# EAGLE design LPC1343_BaseBoard_V1.6 (EAGLE 6.0)
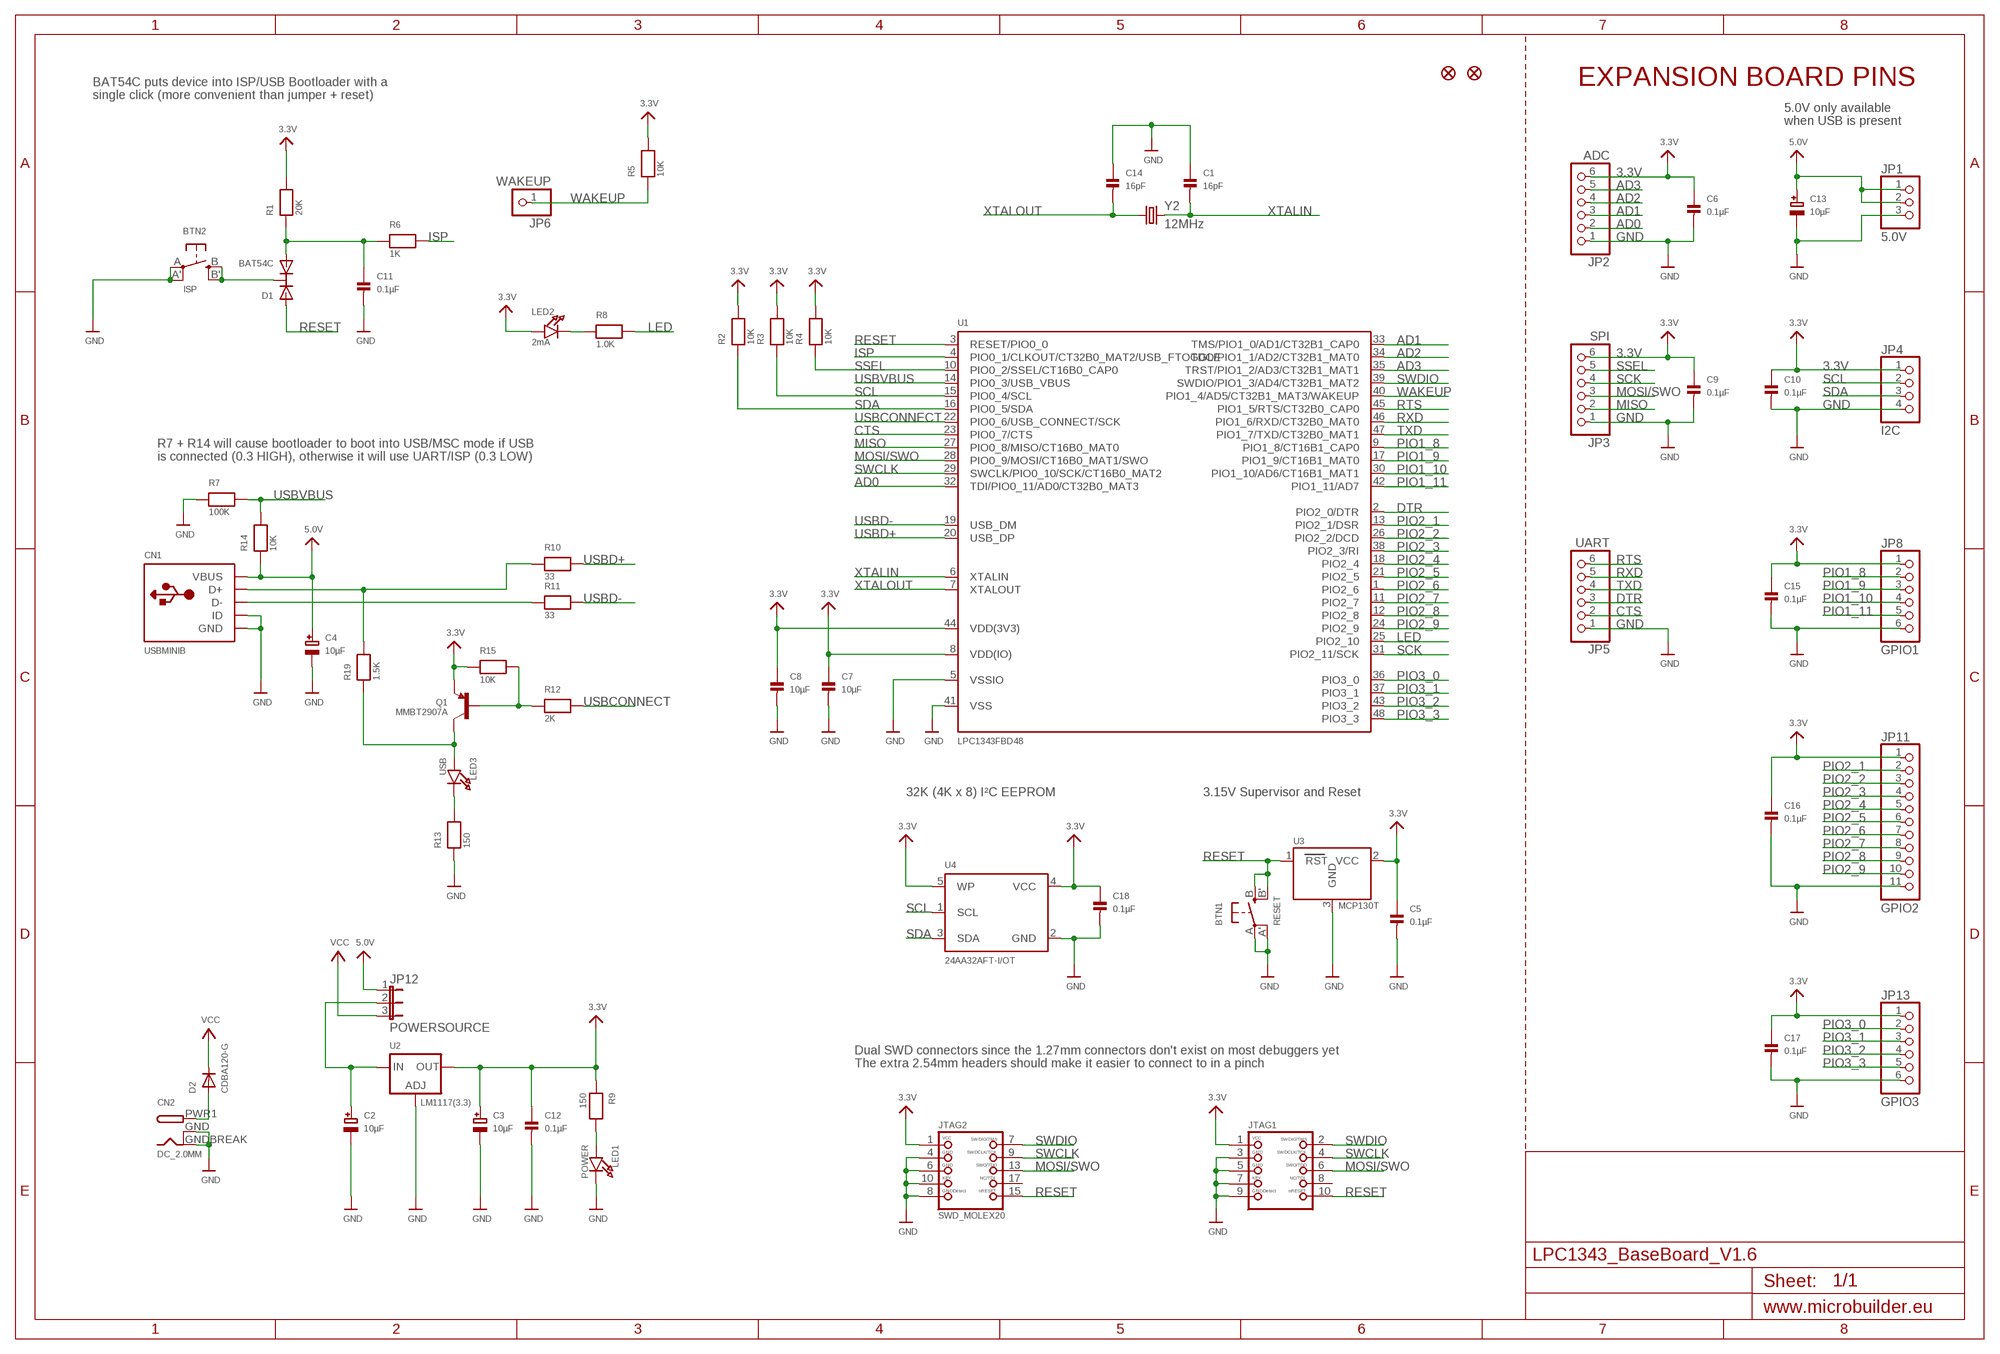
[diagram p0: schematic, sheet 1]

## Parts
BTN1  RESET  BUTTON_SMT  [EVQ-Q2]
BTN2  ISP  BUTTON_SMT  [EVQ-Q2]
C1  16pF  CAP_CERAMIC0603  [0603]
C2  10µF  CAP_TANTALUMA/3216_REFLOW  [EIA3216-18/A-R]
C3  10µF  CAP_TANTALUMA/3216_REFLOW  [EIA3216-18/A-R]
C4  10µF  CAP_TANTALUMA/3216_REFLOW  [EIA3216-18/A-R]
C5  0.1µF  CAP_CERAMIC0603  [0603]
C6  0.1µF  CAP_CERAMIC0603  [0603]
C7  10µF  CAP_CERAMIC0805  [0805]
C8  10µF  CAP_CERAMIC0805  [0805]
C9  0.1µF  CAP_CERAMIC0603  [0603]
C10  0.1µF  CAP_CERAMIC0603  [0603]
C11  0.1µF  CAP_CERAMIC0603  [0603]
C12  0.1µF  CAP_CERAMIC0603  [0603]
C13  10µF  CAP_TANTALUMA/3216_REFLOW  [EIA3216-18/A-R]
C14  16pF  CAP_CERAMIC0603  [0603]
C15  0.1µF  CAP_CERAMIC0603  [0603]
C16  0.1µF  CAP_CERAMIC0603  [0603]
C17  0.1µF  CAP_CERAMIC0603  [0603]
C18  0.1µF  CAP_CERAMIC0603  [0603]
CN1  USBMINIB  [USB-MINIB]
CN2  DC_2.0MM  DCBARRELSMT  [DCJACK_2MM_SMT]
D1  BAT54C  [SOT23-R]
D2  CDBA120-G  DIODESMA  [SMADIODE]
JP1  5.0V  HEADER-1X3ROUND  [1X03_ROUND]
JP2  ADC  HEADER-1X6ROUND  [1X06_ROUND]
JP3  SPI  HEADER-1X6ROUND  [1X06_ROUND]
JP4  I2C  HEADER-1X4ROUND  [1X04_ROUND]
JP5  UART  HEADER-1X6ROUND  [1X06_ROUND]
JP6  WAKEUP  HEADER-1X1ROUND  [1X01_ROUND]
JP7  FIDUCIAL1X2.5  [FIDUCIAL-1X2.5]
JP8  GPIO1  HEADER-1X6ROUND  [1X06_ROUND]
JP9  FIDUCIAL1X2.5  [FIDUCIAL-1X2.5]
JP11  GPIO2  HEADER-1X11  [1X11_ROUND]
JP12  POWERSOURCE  JUMPER3  [JUMPER3]
JP13  GPIO3  HEADER-1X6ROUND  [1X06_ROUND]
JTAG1  JTAG-CORTEXM3  [2X05_1.27MM_SMT]
JTAG2  SWD_MOLEX20  JTAG-CORTEXM3MOLEX20  [JTAG-ARM]
LED1  POWER  LED0805  [CHIPLED_0805]
LED2  2mA  LED0805  [CHIPLED_0805]
LED3  USB  LED0805  [CHIPLED_0805]
Q1  MMBT2907A  TRANSISTOR_PNPSOT23-REFLOW  [SOT23-R]
R1  20K  RESISTOR0603  [0603]
R2  10K  RESISTOR0603  [0603]
R3  10K  RESISTOR0603  [0603]
R4  10K  RESISTOR0603  [0603]
R5  10K  RESISTOR0603  [0603]
R6  1K  RESISTOR0603  [0603]
R7  100K  RESISTOR0603  [0603]
R8  1.0K  RESISTOR0603  [0603]
R9  150  RESISTOR0603  [0603]
R10  33  RESISTOR0603  [0603]
R11  33  RESISTOR0603  [0603]
R12  2K  RESISTOR0603  [0603]
R13  150  RESISTOR0603  [0603]
R14  10K  RESISTOR0603  [0603]
R15  10K  RESISTOR0603  [0603]
R19  1.5K  RESISTOR0603  [0603]
U1  LPC1343FBD48  LPC1343_QFP  [LQFP48]
U2  LM1117(3.3)  LM1117SOT223-REFLOW  [SOT223-R]
U3  MCP130T  MCP130TREFLOW  [SOT23-R]
U4  24AA32AFT-I/OT  MCP24AA32  [SOT23-5]
Y2  12MHz  CRYSTALHC49S  [HC49/S]

## Nets
3.3V: C3.+ C5.1 C6.1 C7.1 C8.1 C9.1 C10.1 C12.1 C15.1 C16.1 C17.1 C18.1 JP2.6 JP3.6 JP4.1 JP8.1 JP11.1 JP13.1 JTAG1.1 JTAG2.1 LED2.A Q1.2(E) R1.2 R2.2 R3.2 R4.2 R5.2 R9.1 R15.1 U1.8(VDD(IO)) U1.44(VDD(3V3)) U2.2(OUT) U3.2(VCC) U4.4(VCC) U4.5(WP)
5.0V: C4.+ C13.+ CN1.VBUS JP1.1 JP1.2 JP12.1 R14.1
AD0: JP2.2 U1.32(TDI/PIO0_11/AD0/CT32B0_MAT3)
AD1: JP2.3 U1.33(TMS/PIO1_0/AD1/CT32B1_CAP0)
AD2: JP2.4 U1.34(TDO/PIO1_1/AD2/CT32B1_MAT0)
AD3: JP2.5 U1.35(TRST/PIO1_2/AD3/CT32B1_MAT1)
CTS: JP5.2 U1.23(PIO0_7/CTS)
DTR: JP5.3 U1.2(PIO2_0/DTR)
GND: BTN1.A'(P1) BTN1.A(P) BTN2.A'(P1) BTN2.A(P) C1.1 C2.- C3.- C4.- C5.2 C6.2 C7.2 C8.2 C9.2 C10.2 C11.2 C12.2 C13.- C14.1 C15.2 C16.2 C17.2 C18.2 CN1.GND CN1.ID CN2.GND(GNDBREAK) CN2.GNDBREAK(GND) JP1.3 JP2.1 JP3.1 JP4.4 JP5.1 JP8.6 JP11.11 JP13.6 JTAG1.3 JTAG1.5 JTAG1.7 JTAG1.9 JTAG2.4 JTAG2.6 JTAG2.8 JTAG2.10 LED1.C R7.1 R13.1 U1.5(VSSIO) U1.41(VSS) U2.1(ADJ) U3.3(GND) U4.2(GND)
ISP: R6.2 U1.4(PIO0_1/CLKOUT/CT32B0_MAT2/USB_FTOGGLE)
LED: R8.2 U1.25(PIO2_10)
MISO: JP3.2 U1.27(PIO0_8/MISO/CT16B0_MAT0)
MOSI/SWO: JP3.3 JTAG1.6 JTAG2.13 U1.28(PIO0_9/MOSI/CT16B0_MAT1/SWO)
N$1: LED2.C R8.1
N$2: C2.+ JP12.2 U2.3(IN)
N$4: CN2.PWR1(PWR) D2.A
N$5: BTN2.B'(S1) BTN2.B(S) D1.3(C)
N$7: CN1.D+ R10.1 R19.2
N$8: Q1.1(B) R12.1 R15.2
N$9: C11.1 D1.2(A2) R1.1 R6.1
N$10: LED1.A R9.2
N$11: LED3.C R13.2
N$12: CN1.D- R11.1
N$13: LED3.A Q1.3(C) R19.1
PIO1_8: JP8.2 U1.9(PIO1_8/CT16B1_CAP0)
PIO1_9: JP8.3 U1.17(PIO1_9/CT16B1_MAT0)
PIO1_10: JP8.4 U1.30(PIO1_10/AD6/CT16B1_MAT1)
PIO1_11: JP8.5 U1.42(PIO1_11/AD7)
PIO2_1: JP11.2 U1.13(PIO2_1/DSR)
PIO2_2: JP11.3 U1.26(PIO2_2/DCD)
PIO2_3: JP11.4 U1.38(PIO2_3/RI)
PIO2_4: JP11.5 U1.18(PIO2_4)
PIO2_5: JP11.6 U1.21(PIO2_5)
PIO2_6: JP11.7 U1.1(PIO2_6)
PIO2_7: JP11.8 U1.11(PIO2_7)
PIO2_8: JP11.9 U1.12(PIO2_8)
PIO2_9: JP11.10 U1.24(PIO2_9)
PIO3_0: JP13.2 U1.36(PIO3_0)
PIO3_1: JP13.3 U1.37(PIO3_1)
PIO3_2: JP13.4 U1.43(PIO3_2)
PIO3_3: JP13.5 U1.48(PIO3_3)
RESET: BTN1.B'(S1) BTN1.B(S) D1.1(A1) JTAG1.10 JTAG2.15 U1.3(RESET/PIO0_0) U3.1(RST)
RTS: JP5.6 U1.45(PIO1_5/RTS/CT32B0_CAP0)
RXD: JP5.5 U1.46(PIO1_6/RXD/CT32B0_MAT0)
SCK: JP3.4 U1.31(PIO2_11/SCK)
SCL: JP4.2 R3.1 U1.15(PIO0_4/SCL) U4.1(SCL)
SDA: JP4.3 R2.1 U1.16(PIO0_5/SDA) U4.3(SDA)
SSEL: JP3.5 R4.1 U1.10(PIO0_2/SSEL/CT16B0_CAP0)
SWCLK: JTAG1.4 JTAG2.9 U1.29(SWCLK/PIO0_10/SCK/CT16B0_MAT2)
SWDIO: JTAG1.2 JTAG2.7 U1.39(SWDIO/PIO1_3/AD4/CT32B1_MAT2)
TXD: JP5.4 U1.47(PIO1_7/TXD/CT32B0_MAT1)
USBCONNECT: R12.2 U1.22(PIO0_6/USB_CONNECT/SCK)
USBD+: R10.2 U1.20(USB_DP)
USBD-: R11.2 U1.19(USB_DM)
USBVBUS: R7.2 R14.2 U1.14(PIO0_3/USB_VBUS)
VCC: D2.C JP12.3
WAKEUP: JP6.1 R5.1 U1.40(PIO1_4/AD5/CT32B1_MAT3/WAKEUP)
XTALIN: C1.2 U1.6(XTALIN) Y2.2
XTALOUT: C14.2 U1.7(XTALOUT) Y2.1
Unconnected: JTAG1.8 JTAG2.17

## Notes on the sheet
- BAT54C puts device into ISP/USB Bootloader with a | EXPANSION BOARD PINS
- single click (more convenient than jumper + reset)
- 5.0V only available
- when USB is present
- R7 + R14 will cause bootloader to boot into USB/MSC mode if USB
- is connected (0.3 HIGH), otherwise it will use UART/ISP (0.3 LOW)
- 32K (4K x 8) I²C EEPROM | 3.15V Supervisor and Reset
- Dual SWD connectors since the 1.27mm connectors don't exist on most debuggers yet
- The extra 2.54mm headers should make it easier to connect to in a pinch

## Library data of the parts
BTN1 BTN2 = microbuilder:BUTTON_SMT: SMT Push Button (6mm) Digikey: P12940SCT-ND
C1 C5-C12 C14-C18 = microbuilder:CAP_CERAMIC: Ceramic Capacitors 0402 - 0402 Surface Mount Capacitors 16pF 50V 5% [Digikey: 445-4899-2-ND] 18pF 50V 5% [Digikey: 490-1281-2-ND] 22pF 50V 5% [Digikey: 490-1283-2-ND] 68pF 50V 5% [Digikey: 490-1289-2-ND] 0.1uF 10V 10% [Digikey: 490-1318-2-ND] 0603 - 0603 Surface Mount Capacitors 16 pF 50V 5% [Digikey: 445-5051-2-ND] 22 pF 50V [Digikey: PCC220ACVTR-ND] 33 pF 50V 5% [Digikey: 490-1415-1-ND] 56pF 50V 5% [Digikey: 490-1421-1-ND] 220pF 50V 5% [Digikey: 445-1285-1-ND] 680 pF 50V 2200 pF 50V 5% C0G [Digikey: 445-1297-1-ND] 5600 pF 100V 5% X7R [Digikey: 478-3711-1-ND] 0.1 µF 25V 10% [Digikey: PCC2277TR-ND] 0.22 µF 16V 10% X7R [Digikey: 445-1318-1-ND] 1.0 µF 25V 10% [Digikey: 445-5146-2-ND] 0603 - RF Specific 3pF 250V +/-0.1pF RF [Digikey: 712-1347-1-ND] 18 pF 250V 5% [Digikey: 478-3505-1-ND or 712-1322-1-ND] 56 pF 250V 5% C0G RF [Digikey: 490-4867-1-ND] 68 pF 250V RF [Digikey: 490-4868-1-ND] 0805 - 0805 Surface Mount Capacitors 220 pF 250V 2% RF Ceramic Capacitor [Digikey: 712-1398-1-ND] 1000 pF 50V 2% NP0 Ceramic Capacitor [Digikey: 478-3760-1-ND] 0.1 µF 25V 10% Ceramic Capacitor [Digikey: PCC1828TR-ND] 1.0 µF 16V 10% Ceramic Capacitor[Digikey: 490-1691-2-ND] 10.0 µF 10V 10% Ceramic Capacitor[Digikey: 709-1228-1-ND] 47 uF 6.3V 20% Ceramic Capacitor [Digikey: 399-5506-1-ND] 1206 - 1206 Surface Mount Capacitors 47uF 10V 20% Ceramic Capacitor [Digikey: 399-5508-1-ND]
C2-C4 C13 = microbuilder:CAP_TANTALUM: Tantalum Capacitors Wave footprints have larger pads and are meant to be used for hand soldering. Reflow footprints are optimised for solder paste and a reflow oven. EIA3216-18/A-[R/W] - Size A / 3216-18 / 1206 footprint 4.7µF 25V 10% Tantalum Capacitor 10µF 16V 10% Tantalum Capacitor [Digikey: 495-2236-2-ND] EIA3528-21/B-[R/W] - Size B / 3528-21 47µF 10V 10% Tantalum Capactior [Digikey: 495-2216-1-ND] EIA6032-28/C-[R/W] - Size C / 6032-28 10µF 35V 20% Tantalum Capacitor [Digikey: 495-2285-1-ND] 100µF 16V 10% Tantalum Capactior [Digikey: 399-5214-1-ND]
CN1 = microbuilder:USB: USB Connectors USBMINIB - Surface Mount Female Mini-B USB Connector 4UConnector: 06564
CN2 = microbuilder:DCBARREL: 2.0mm DC Barrel Jack DCJACK_2MM_PTH - Through Hole Jack (4UConnector: 05537) DCJACK_2MM_SMT - SMT Version (4UConnector: 03267)
D1 = microbuilder:BAT54C: BAT54C Schottky Diodes (Common Cathode) 30V 200mA, SOT-23 Package Digikey: BAT54CFSCT-ND
D2 = microbuilder:DIODE: Diode SMADIODE - SMA Surface Mount Package 20V 1A Schottky Diode Digikey (500mV @ 1A, 500uA Vr @ 20V): 641-1014-6-ND SOD-123 30V 500mA (430mV Vf, 130uA Vr @ 30V) Schottky Diode - Digikey: B0530W-FDICT-ND SOD-323 10V 570mA (380mV Vf, 3ns) Schottky Diode - Digikey: ZLLS410CT-ND 1N4148WS - 75V 150mA (1V Vf @ 10mA, 4ns) Simple Diode - Digikey: 1N4148WSFSCT-ND, Mouser: 512-1N4148WS SOD-523 30V 30mA Schottky Diode (RB751S-40TE61) - Digikey: RB751S-40TE61CT-ND SOT23-R/W - SOT23 Package (R = Solder Paste/Reflow Ovens, W = Hand-Soldering) BAT54Film 40V 300mA - Digikey: 497-7162-1-ND DO-1N4148 Through Hole Small Current Diode (any model)
JP1 = microbuilder:HEADER-1X3: PIN HEADER
JP2 JP3 JP5 JP8 JP13 = microbuilder:HEADER-1X6: PIN HEADER
JP4 = microbuilder:HEADER-1X4: PIN HEADER
JP6 = microbuilder:HEADER-1X1: PIN HEADER
JP7 JP9 = microbuilder:FIDUCIAL: Fiducial Alignment Points Various fiducial points for machine vision alignment.
JP11 = microbuilder:HEADER-1X11
JP12 = microbuilder:JUMPER3: JUMPER - 3 Pins
JTAG1 JTAG2 = microbuilder:JTAG-CORTEXM3: Serial Wire (SW-DP) Connector This standard 0.05" 10-pin connector is for use with the Cortex M0/M3's native SWD (serial wire debugger) interface (SW-DP). Some boards support a 20-pin combined JTAG+SWD connector (SWJ-DP), such as the LPC1700 family, but many smaller devices only work with SWD which typically use the smaller 10-pin SW-DP connecter (the LPC1300 family, for example, only supports SWD). 2x05 1.27mm/0.05" Connector: This is the standard SMT connector defined by ARM for all Cortex devices, and should be used in most situations and for forward-compatibility since any new devices coming to market will likely use this connector. MOLEX 10 Pin 0.1" Connector: This 0.1" 10 pin connector has the same pin layout as the standard 0.05" connector, but is easier to work with if you are using standard jumper wires or custom cables to connect your SWD hardware. MOLEX 20 Pin 0.1" Connector: This 0.1" 20 pin connector is the same model used for ARM7/ARM9 JTAG debuggers, but is connected to match the pins on the Segger J-Link for ARM (which supports both JTAG and SWD debugging). See the following document from ARM for more information on Cortex M3 Debug Connectors: http://infocenter.arm.com/help/topic/com.arm.doc.faqs/attached/13634/cortex_debug_connectors.pdf And the following page for an overview with images of the different connector types: http://www.keil.com/peripherals/coresight/connectors.asp
LED1-LED3 = microbuilder:LED: LED 0603 - 0603 Surface Mount Package Green LED - Low Power (3.9mcd, 2ma, 1.7Vf) Orange LED - Low Power (9.8mcd, 2ma, 1.8Vf) Red LED - Low Power (5mcd, 2ma, 1.8Vf) Yellow LED - Low Power (7mcd, 2ma, 1.8Vf) 0805 - 0805 Surface Mount Package 20mA: Red LED (104mcd, 20mA, Diffused) - LS R976 [Digikey: 475-1278-6-ND] Red LED (12mcd, 20mA, 2.0Vf, Clear) - APT2012EC [Digikey: 754-1128-1-ND] Green LED (15mcd, 20mA, 2.2Vf, Clear) - APT2012GC [Digikey: 754-1131-1-ND] Orange LED (160mcd, 20mA, 2.1Vf, Clear) - APT2012SECK [Digikey: 754-1130-1-ND] 2mA: Red LED (8.8mcd, 2mA, 1.8Vf, Clear) - Low Power [Digikey: 475-2510-1-ND] Green LED (5mcd, 2mA, 1.8Vf, Clear) - Low Power [Digikey: 475-2730-1-ND] Yellow LED (11.3mcd, 2mA, 1.8Vf, Clear) - Low Power [Digikey: 475-2555-1-ND] 1206 - 1206 Surface Mount Package Green LED (26mcd, 20mA, Diffused) - LG N971 [Digikey: 475-1407-6-ND] Red LED (15mcd, 20mA, Diffused) - LH N974 [Digikey: 475-1416-6-ND]
Q1 = microbuilder:TRANSISTOR_PNP: PNP Transistor Transistor (PNP) 800mA 60V [Digikey: MMBT2907AFSTR-ND] SOT23-R - SOT23 footprint optimised for use with solder paste and reflow ovens. SOT23-W - SOT23 footprint optimised for hand-soldering (larger pads).
R1-R15 R19 = microbuilder:RESISTOR: Resistors 0402 - 0402 Surface Mount Package 22 Ohm 1% 1/16W [Digikey: 311-22.0LRTR-ND] 10.0K 1% 1/16W [Digikey: 311-10.0KLRTR-ND] 10.0K 5% 1/16W [Digikey: RMCF0402JT10K0TR-ND] 12.1K 1% 1/16W [Digikey: 311-22.0LRTR-ND] 0603 - 0603 Surface Mount Package 0 Ohm 1/10 Watt 1% Resistor 15 Ohm 1/10 Watt 1% Resistor 33 Ohm 1/10 Watt 1% Resistor 49.9 Ohm 1/10 Watt 1% Resistor 100 Ohm 1/10 Watt 1% Resistor 150 Ohm 1/10 Watt 1% Resistor 240 Ohm 1/10 Watt 1% Resistor 390 Ohm 1/10 Watt 1% Resistor 560 Ohm 1/10 Watt 1% Resistor 750 Ohm 1/10 Watt 1% Resistor 1.0K Ohm 1/10 Watt 1% Resistor 1.5K Ohm 1/10 Watt 1% Resistor 2.0K Ohm 1/10 Watt 1% Resistor 4.7K Ohm 1/10 Watt 1% Resistor 10.0K Ohm 1/10 Watt 1% Resistor 20.0K Ohm 1/10 Watt 1% Resistor 33.0K Ohm 1/10 Watt 1% Resistor 100.0K Ohm 1/10 Watt 1% Resistor 0805 - 0805 Surface Mount Package 0 Ohm 1/8 Watt 1% Resistor 33 Ohm 1/8 Watt 1% Resistor 100 Ohm 1/8 Watt 1% Resistor 150 Ohm 1/8 Watt 1% Resistor 200 Ohm 1/8 Watt 1% Resistor 240 Ohm 1/8 Watt 1% Resistor 330 Ohm 1/8 Watt 1% Resistor 390 Ohm 1/8 Watt 1% Resistor 470 Ohm 1/8 Watt 1% Resistor 1.0K Ohm 1/8 Watt 1% Resistor 1.5K Ohm 1/8 Watt 1% Resistor 2.0K Ohm 1/8 Watt 1% Resistor 4.7K Ohm 1/8 Watt 1% Resistor 5.1K Ohm 1/8 Watt 1% Resistor 5.6K Ohm 1/8 Watt 1% Resistor 10.0K Ohm 1/8 Watt 1% Resistor 22.0K Ohm 1/8 Watt 1% Resistor 33.0K Ohm 1/8 Watt 1% Resistor 100K Ohm 1/8 Watt 1% Resistor 1206 - 1206 Surface Mount Package
U1 = microbuilder:LPC1343_QFP: LPC1343 72 MHz 32-bit ARM Cortex-M3 microcontroller. 32 kB Flash, 8 kB SRAM, USB Device Mouser: 771-LPC1343FBD48151 Digikey: 568-4945-ND
U2 = microbuilder:LM1117: LM1117 Voltage Regulator LM1117 Adjustable Voltage regulator [Digikey: LM1117IMP-ADJDKR-ND] LM1117 3.3V Voltage regulator [AP1117E33GDIDKR-ND] LM1117 5.0V Voltage regulator [AP1117E50GDIDKR-ND] SOT223-REFLOW - SOT223 package for solder paste/reflow ovens SOT223-WAVE - SOT223 package for hand-soldering (larger pads) Note: For the fixed-voltage regulators, simply set the ADJ pin to GND.
U3 = microbuilder:MCP130T: MCP130T Voltage Supervisor (Active Low) Voltage supervisors will put the MCU in a reset state if the voltage drops below a pre-determined level. SOT23-R/SOT23-W: Voltage Supervisor - 3.15V Active Low Note: Use the "Reflow" footprint when working with solder paste, and the "Wave" footprint when soldering by hand with a soldering iron (the latter has larger pads that are easier to solder by hand). Digikey: MCP130T-315I/TTCT-ND
U4 = microbuilder:MCP24AA32: Microchip 32K (4K x 8) 1.8V I2C EEPROM SOT23-5 [Digikey: 24AA32AFT-I/OTCT-ND]
Y2 = crystal:CRYSTAL: CRYSTAL; OC_FARNELL: 1667008; OC_NEWARK: unknown

## Board
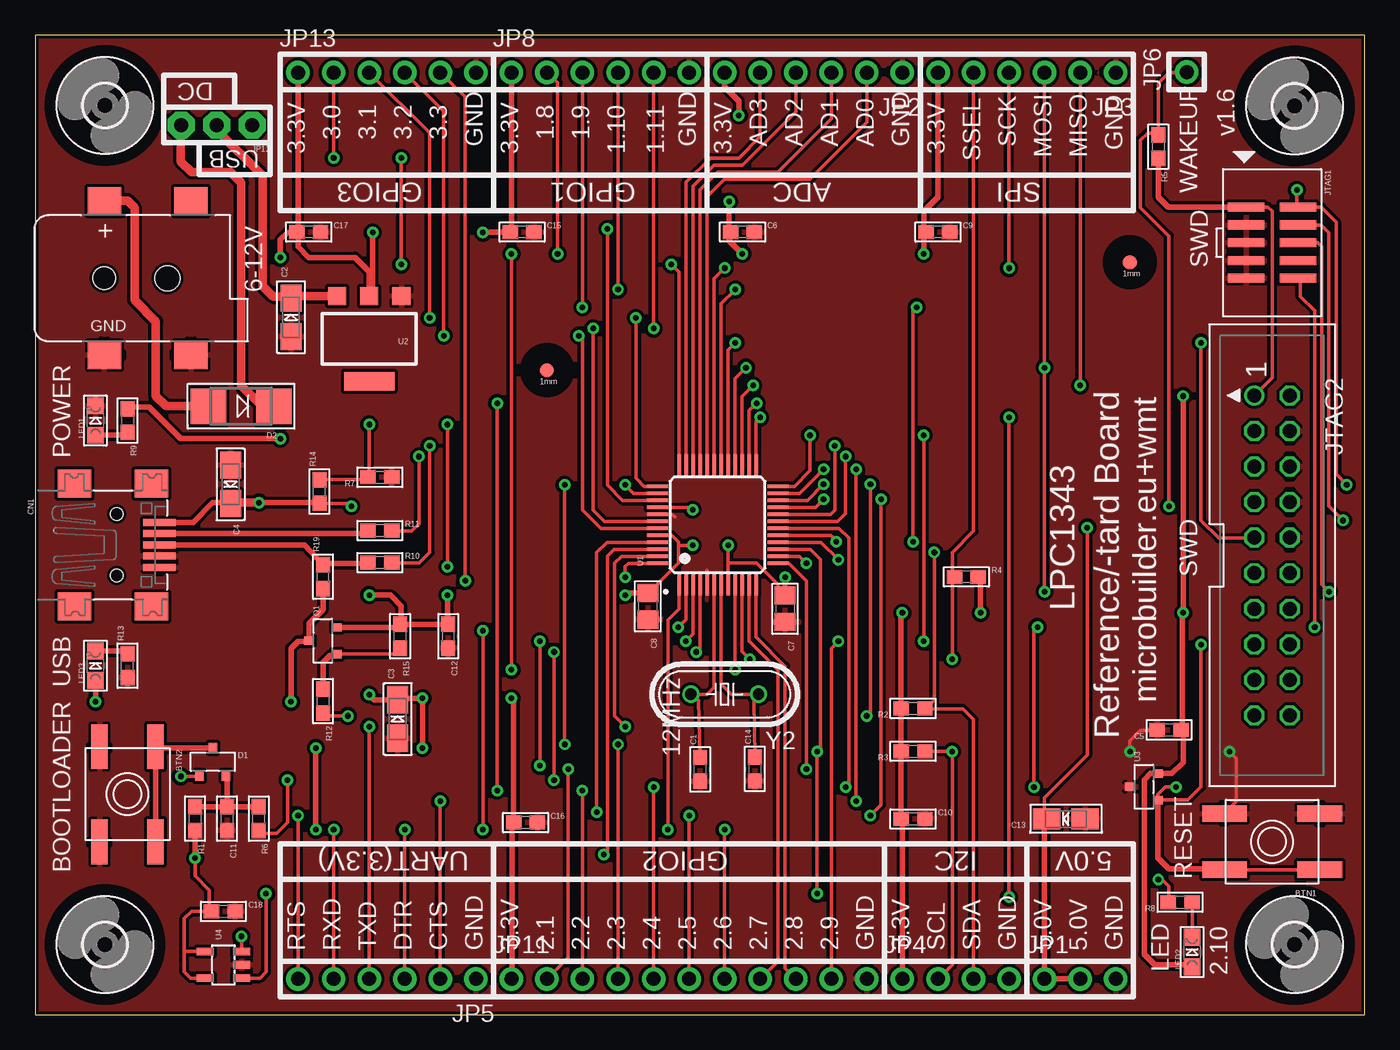
[diagram p1: board, top side]
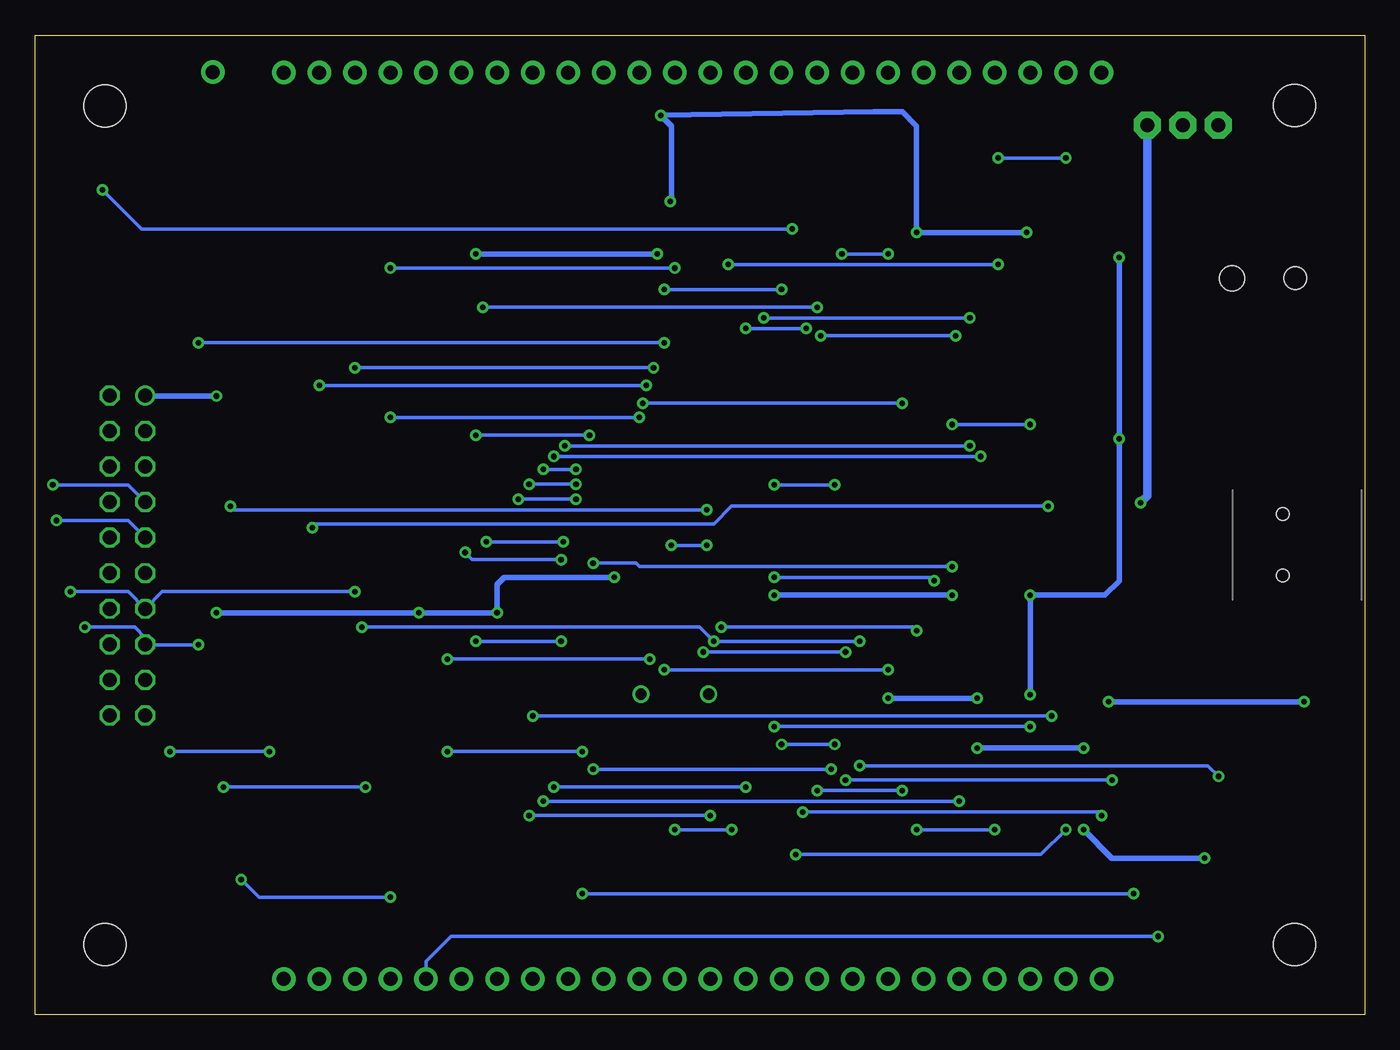
[diagram p2: board, bottom side, seen from below]

Size 95 x 70 mm. Coordinates in mm from the lower left corner, seen from the top.
Outline: 95,0 95,70 0,70 0,0 95,0
Copper layers (1*16): Top 0.035mm / dielectric 1.5mm / Bottom 0.035mm
Design rules: minimum track width 0.21mm, minimum drill 0.4mm, track to track 0.21mm, track to pad 0.21mm, pad to pad 0.21mm, via to via 0.21mm, smd to smd 0.21mm, copper to edge 0.21mm, drill to drill 8mil, minimum pad ring 0.21mm, minimum via ring 0.21mm, stop-mask expansion 3mil, vias tented up to drill 0mil, thermal gap 8mil
tRestrict: area 8.7,32.3 to 9.1,32.4; area 30.5,2.3 to 30.6,2.7; area 31.3,3.5 to 31.7,3.5; area 32.4,2.3 to 32.5,2.7; area 59.2,3.5 to 59.6,3.5; area 60.4,2.3 to 60.4,2.7; area 68.6,2.3 to 68.7,2.7; area 69.4,3.5 to 69.8,3.5; area 70.5,2.3 to 70.6,2.7; area 76.2,2.3 to 76.3,2.7; area 77,3.5 to 77.4,3.5; area 78.2,2.3 to 78.2,2.7; 33 more areas

### Footprints (pad centres in the part's own frame; a part is rotated, then mirrored left to right if it is on the bottom)
EVQ-Q2 = smd 3.2 x 1.2: A -3.4,-2; A' 3.4,-2; B -3.4,2; B' 3.4,2
0603 = smd 1.1 x 1: 1 -0.85,0; 2 0.85,0
EIA3216-18/A-R = smd 1.95 x 1.5: + 1.375,0; - -1.375,0
0805 = smd 1.3 x 1.5: 1 -0.95,0; 2 0.95,0
USB-MINIB = smd 0.5 x 2.308: D+ 0,4.064; D- -0.8,4.064; GND 1.6,4.064; ID 0.8,4.064; VBUS -1.6,4.064 | smd 2 x 2.4: GND1 -4.4,-2; GND2 -4.4,3.5; GND3 4.4,3.5; GND4 4.4,-2 | hole 0.9: -2.2,1; 2.2,1
DCJACK_2MM_SMT = smd 2.4 x 2: GND 0,-5.5; GNDBREAK 6.2,-5.5; PWR1 0,5.5; PWR2 6.2,5.5 | hole 1.6: 0,0 | hole 1.8: 4.5,0
SOT23-R = smd 0.6 x 0.7: 1 -0.95,-1; 2 0.95,-1; 3 0,1
SMADIODE = smd 2.54 x 2.54: A 2.349,0; C -2.349,0
1X03_ROUND = drill 1 pad 1.676: 1 -2.54,0; 2 0,0; 3 2.54,0
1X06_ROUND = drill 1 pad 1.676: 1 -6.35,0; 2 -3.81,0; 3 -1.27,0; 4 1.27,0; 5 3.81,0; 6 6.35,0
1X04_ROUND = drill 1 pad 1.676: 1 -3.81,0; 2 -1.27,0; 3 1.27,0; 4 3.81,0
1X01_ROUND = drill 1 pad 1.676: 1 0,0
FIDUCIAL-1X2.5 = smd 1 x 1: 1 0,0
1X11_ROUND = drill 1 pad 1.676: 1 -12.7,0; 2 -10.16,0; 3 -7.62,0; 4 -5.08,0; 5 -2.54,0; 6 0,0; 7 2.54,0; 8 5.08,0; 9 7.62,0; 10 10.16,0; 11 12.7,0
JUMPER3 = drill 1 pad 1.93 octagon: 1 -2.54,0; 2 0,0; 3 2.54,0
2X05_1.27MM_SMT = smd 0.65 x 2.6: 1 -2.54,-1.85; 2 -2.54,1.85; 3 -1.27,-1.85; 4 -1.27,1.85; 5 0,-1.85; 6 0,1.85; 7 1.27,-1.85; 8 1.27,1.85; 9 2.54,-1.85; 10 2.54,1.85
JTAG-ARM = drill 1: 1 -11.43,-1.27 | drill 1 octagon: 2 -11.43,1.27; 3 -8.89,-1.27; 4 -8.89,1.27; 5 -6.35,-1.27; 6 -6.35,1.27; 7 -3.81,-1.27; 8 -3.81,1.27; 9 -1.27,-1.27; 10 -1.27,1.27; 11 1.27,-1.27; 12 1.27,1.27; 13 3.81,-1.27; 14 3.81,1.27; 15 6.35,-1.27; 16 6.35,1.27; 17 8.89,-1.27; 18 8.89,1.27; 19 11.43,-1.27; 20 11.43,1.27
CHIPLED_0805 = smd 1.2 x 1.2: A 0,-1.05; C 0,1.05
LQFP48 = smd 1.5 x 0.25: 1 -4.3,2.75; 2 -4.3,2.25; 3 -4.3,1.75; 4 -4.3,1.25; 5 -4.3,0.75; 6 -4.3,0.25; 7 -4.3,-0.25; 8 -4.3,-0.75; 9 -4.3,-1.25; 10 -4.3,-1.75; 11 -4.3,-2.25; 12 -4.3,-2.75; 25 4.3,-2.75; 26 4.3,-2.25; 27 4.3,-1.75; 28 4.3,-1.25; 29 4.3,-0.75; 30 4.3,-0.25; 31 4.3,0.25; 32 4.3,0.75; 33 4.3,1.25; 34 4.3,1.75; 35 4.3,2.25; 36 4.3,2.75 | smd 0.25 x 1.5: 13 -2.75,-4.3; 14 -2.25,-4.3; 15 -1.75,-4.3; 16 -1.25,-4.3; 17 -0.75,-4.3; 18 -0.25,-4.3; 19 0.25,-4.3; 20 0.75,-4.3; 21 1.25,-4.3; 22 1.75,-4.3; 23 2.25,-4.3; 24 2.75,-4.3; 37 2.75,4.3; 38 2.25,4.3; 39 1.75,4.3; 40 1.25,4.3; 41 0.75,4.3; 42 0.25,4.3; 43 -0.25,4.3; 44 -0.75,4.3; 45 -1.25,4.3; 46 -1.75,4.3; 47 -2.25,4.3; 48 -2.75,4.3
SOT223-R = smd 1.3 x 1.3: 1 -2.3,-3.05; 2 0,-3.05; 3 2.3,-3.05 | smd 3.6 x 1.3: 4 0,3.05
SOT23-5 = smd 0.55 x 1.2: 1 -0.95,-1.3; 2 0,-1.3; 3 0.95,-1.3; 4 0.95,1.3; 5 -0.95,1.3
MOUNTINGHOLE_3.0 = hole 3: 0,0
HC49/S = drill 0.813: 1 -2.413,0; 2 2.413,0

### Placement (x,y rotation side)
BTN1  88.4,12.35 180 top
BTN2  6.61,15.75 270 top
C1  47.52,17.52 90 top
C2  18.29,49.82 90 top
C3  25.91,21.12 90 top
C4  13.97,37.89 270 top
C5  81.03,20.34 180 top
C6  50.55,55.92 0 top
C7  53.6,29 270 top
C8  43.79,29.17 270 top
C9  64.52,55.92 0 top
C10  62.74,13.97 0 top
C11  13.73,13.99 270 top
C12  29.53,27.04 270 top
C13  73.66,13.97 180 top
C14  51.44,17.55 90 top
C15  34.8,55.92 0 top
C16  35.06,13.72 0 top
C17  19.56,55.92 0 top
C18  13.47,7.37 0 top
CN1  4.83,33.56 270 top
CN2  4.96,52.62 0 top
D1  12.7,18.06 0 top
D2  14.74,43.47 180 top
JP1  74.68,2.54 0 top
JP2  55.63,67.31 180 top
JP3  70.87,67.31 180 top
JP4  65.79,2.54 0 top
JP5  25.15,2.54 180 top
JP6  82.3,67.35 90 top
JP7  78.23,53.75 0 top
JP8  40.39,67.31 0 top
JP9  36.58,46.04 0 top
JP11  46.74,2.54 0 top
JP12  12.99,63.57 180 top
JP13  25.15,67.31 0 top
JTAG1  88.4,55.16 270 top
JTAG2  88.4,32.81 270 top
LED1  4.32,42.45 0 top
LED2  82.68,4.46 0 top
LED3  4.32,24.92 0 top
Q1  20.58,26.71 90 top
R1  11.44,13.99 270 top
R2  62.74,21.88 180 top
R3  62.74,18.81 180 top
R4  66.55,31.28 0 top
R5  80.27,62.02 270 top
R6  15.99,13.99 270 top
R7  24.64,38.39 180 top
R8  81.82,8.03 180 top
R9  6.61,42.45 270 top
R10  24.64,32.3 0 top
R11  24.64,34.58 0 top
R12  20.58,22.39 270 top
R13  6.61,24.92 90 top
R14  20.32,37.38 90 top
R15  26.09,27.04 270 top
R19  20.58,31.28 90 top
U1  48.77,35 90 top
U2  23.88,48.3 180 top
U3  79.24,16.27 90 top
U4  13.47,3.56 90 top
U$52  [MOUNTINGHOLE_3.0]  5,5 90 top
U$54  [MOUNTINGHOLE_3.0]  5,64.96 90 top
U$55  [MOUNTINGHOLE_3.0]  90,5 90 top
U$56  [MOUNTINGHOLE_3.0]  90,64.93 90 top
Y2  49.28,22.88 180 top

### Tracks (layer width: path | path; a pad name or v marks a point on that pad's centre or on a via)
3.3V  (via drill 0.4)
  Top 0.254: JTAG1.1 88.1,57.7 88.4,57.4 88.4,45.51 JTAG2.1 | 25.76,27.66 R15.1 26.17,28.06 | C7.1 53.09,30.45 53.09,30.73 51.57,32.26 49.53,32.26 49.52,32.25 | C8.1 43.84,30.12 45.98,32.26 45.98,33.53 | 45.98,33.53 45.98,33.78 45.51,34.25 U1.44 | v11.43,11.18 11.44,11.18 11.44,9.9 12.45,8.89 12.45,7.43 C18.1 | 18.57,55.88 C17.1 | 49.52,32.25 U1.8 | 49.52,32.25 49.52,33.52 v49.53,33.53 | 45.98,33.53 v46.99,33.53 | U4.5 11.11,2.61 10.67,3.05 10.67,4.57 | 10.67,4.57 10.67,6.86 11.18,7.37 C18.1 | C18.1 12.17,7.02 | U4.4 10.74,4.51 10.67,4.57
  Top 0.406: JP13.1 18.8,56.11 C17.1 18.8,55.73 18.8,54.86 19.56,54.1 22.86,54.1 23.88,53.09 U2.2 24.13,51.6 v24.13,55.88 | v32.01,55.88 32.05,55.92 C15.1 34.04,56.11 JP8.1 | JP4.1 61.98,13.78 C10.1 R3.2 R2.2 61.89,28.61 v61.98,28.7 | v67.57,28.7 67.57,31.22 R4.2 | LED2.A 82.54,3.56 80.01,3.56 79.25,4.32 79.25,16.76 79.71,17.22 U3.2 81.23,17.22 82.05,18.03 82.05,20.27 C5.1 81.98,20.44 81.98,28.64 v82.05,28.7 v82.05,44.2 | JTAG1.1 80.99,57.7 80.27,58.42 R5.2 | JP3.6 64.52,58.42 63.5,57.4 63.5,55.99 C9.1 63.5,55.85 v63.5,54.36 | 25.76,27.66 Q1.2 | R15.1 C12.1 29.47,28.05 v29.47,29.97 | v23.88,22.86 24.24,22.5 C3.+ 26.02,22.61 v27.69,22.61 v27.69,19.05 | v23.88,29.97 25.4,29.97 26.17,29.21 26.17,28.06 | v50.55,54.36 49.6,55.31 C6.1 49.6,56.02 v49.6,58.1 | C7.1 v53.6,31.24 | C8.1 42.32,30.12 v42.17,29.97 | JP11.1 34.11,2.61 34.11,13.62 C16.1 34.21,22.44 v34.04,22.61 34.11,22.54 | 11.44,11.18 R1.2 | v20.07,13.21 v20.07,19.05 | v17.53,41.15 10.42,41.15 8.17,43.4 6.71,43.4 R9.1 | v17.53,54.1 17.53,55.37 18.04,55.88 18.57,55.88 | JP2.6 49.28,66.29 50.3,65.28 v50.3,64.26
  Bottom 0.254: v46.99,33.53 v49.53,33.53
  Bottom 0.406: v24.13,55.88 v32.01,55.88 32.01,63.5 33.02,64.52 35.06,64.52 v50.3,64.26 49.53,63.5 49.53,58.42 v49.6,58.1 | v82.05,28.7 v67.57,28.7 v61.98,28.7 61.98,30.73 61.47,31.24 v53.6,31.24 | v82.05,44.2 87.09,44.2 JTAG2.1 | v23.88,22.86 v23.88,29.97 18.55,29.97 17.53,30.99 v17.53,41.15 v17.53,54.1 | v50.55,54.36 v63.5,54.36 | v29.47,29.97 v42.17,29.97 | v27.69,22.61 v34.04,22.61 | v11.43,11.18 18.04,11.18 v20.07,13.21 | v20.07,19.05 v27.69,19.05
5.0V  (via drill 0.4)
  Top 0.254: 22.5,36.43 v22.61,36.32 22.4,36.53 R14.1 | v75.19,34.8 75.19,18.54 72.14,15.49 72.14,14.12 C13.+
  Top 0.406: CN1.VBUS 11.29,35.16 12.7,36.58 13.91,36.58 C4.+ | v16.01,36.58 20.18,36.58 R14.1 | JP1.2 JP1.1 72.14,13.82 C13.+
  Top 0.61: v16.01,36.58 14.04,36.58 C4.+
  Bottom 0.254: v22.61,36.32 45.22,36.32 46.49,35.05 74.93,35.05 v75.19,34.8
  Bottom 0.61: JP12.1 15.53,37.05 v16.01,36.58
AD0
  Top 0.254: U1.32 48.02,58.43 49.28,59.69 55.38,59.69 59.44,63.75 JP2.2
AD1
  Top 0.254: U1.33 47.52,58.95 48.77,60.2 53.09,60.2 56.9,64.01 JP2.3
AD2
  Top 0.254: U1.34 47.02,59.21 48.52,60.71 50.55,60.71 54.36,64.52 JP2.4
AD3
  Top 0.254: U1.35 46.52,59.47 48.26,61.21 50.3,61.21 51.82,62.74 JP2.5
CTS  (via drill 0.4)
  Top 0.254: U1.23 54.63,37.25 v56.34,38.96 | v58.68,15.24 v58.68,38.96 | JP5.2 v28.96,15.24
  Bottom 0.254: v58.68,38.96 v56.34,38.96 | v28.96,15.24 v58.68,15.24
DTR  (via drill 0.4)
  Top 0.254: U1.2 46.52,28.23 v45.98,27.69 | v32.01,13.21 v32.01,27.43 | JP5.3 v26.42,13.21
  Bottom 0.254: v45.98,27.69 32.26,27.69 v32.01,27.43 | v26.42,13.21 v32.01,13.21
GND  (via drill 0.4)
  Top 0.254: U1.5 48.02,31.74 48.01,31.75 | U1.41 45.53,35.75 45.72,35.56 | BTN1.A' 85,14.38 85.86,15.24 85.86,18.29 v85.35,18.8 | v78.24,18.8 78.24,19.56 79,20.32 80.06,20.32 C5.2
  Bottom 0.254: v78.24,18.8 v85.35,18.8
  pour Top (isolate 0.229): 0,0 0,70 95,70 95,0
ISP  (via drill 0.4)
  Top 0.254: U1.4 47.52,26.18 v47.25,25.91 | v37.09,16.76 v37.09,25.91 | v18.04,16.76 18.04,13.72 17.28,12.95 16.08,12.95 R6.2
  Bottom 0.254: v37.09,25.91 v47.25,25.91 | v18.04,16.76 v37.09,16.76
LED  (via drill 0.4)
  Top 0.254: U1.25 51.52,42.37 v51.82,42.67 | v69.6,8.38 v69.6,42.67 | v80.27,9.65 80.52,9.65 81.03,9.14 81.03,8.18 R8.2
  Bottom 0.254: v69.6,42.67 v51.82,42.67 | v69.6,8.38 79,8.38 v80.27,9.65
MISO  (via drill 0.4)
  Top 0.254: U1.27 50.52,44.17 v51.31,44.96 | v74.68,44.96 JP3.2
  Bottom 0.254: v51.31,44.96 v74.68,44.96
MOSI/SWO  (via drill 0.4)
  Top 0.254: JTAG1.6 91.66,55.16 91.95,54.86 91.95,30.73 v92.46,30.23 | JP3.3 v72.14,46.23 v72.14,30.23 | U1.28 50.02,45.45 v50.8,46.23
  Bottom 0.254: v92.46,30.23 88.36,30.23 JTAG2.13 85.9,30.23 v72.14,30.23 | v50.8,46.23 v72.14,46.23
N$1
  Top 0.254: LED2.C 82.68,7.93 R8.1
N$2
  Top 0.61: JP12.2 12.99,63.21 16.26,59.94 16.26,52.07 17.02,51.31 18.18,51.31 C2.+ 18.44,51.35 U2.3
N$4
  Top 0.61: D2.A 9.36,43.47 8.64,44.2 8.64,49.53 7.12,51.05 7.12,57.66 6.61,58.17 5,58.17 CN2.PWR1
N$5
  Top 0.406: BTN2.B' BTN2.B 8.7,19.06 D1.3
N$7
  Top 0.406: CN1.D+ 19.25,33.56 R19.2 20.68,32.23 23.63,32.23 R10.1
N$8
  Top 0.254: Q1.1 25.76,25.76 R15.2
  Top 0.406: R12.1 20.58,25.15 21.09,25.65 21.47,25.65 Q1.1
N$9
  Top 0.406: C11.1 13.73,16.98 D1.2 | R1.1 C11.1 | C11.1 R6.1
N$10
  Top 0.406: LED1.A 6.51,41.4 R9.2
N$11
  Top 0.406: LED3.C 6.51,25.97 R13.2
N$12
  Top 0.406: CN1.D- 23.47,34.36 R11.1
N$13  (via drill 0.4)
  Top 0.406: v4.32,22.35 LED3.A | v18.29,22.35 18.29,26.16 18.8,26.67 19.54,26.67 Q1.3 19.58,27.96 20.58,28.96 R19.1
  Bottom 0.406: v4.32,22.35 v18.29,22.35
PIO1_8  (via drill 0.4)
  Top 0.254: U1.9 50.02,25.17 v50.04,24.64 | v34.04,24.64 v34.04,54.36 | v37.34,54.36 37.34,66.59 JP8.2
  Bottom 0.254: v34.04,24.64 v50.04,24.64 | v34.04,54.36 v37.34,54.36
PIO1_9  (via drill 0.4)
  Top 0.254: U1.17 56.89,34.25 v57.26,33.78 | v62.74,33.78 62.74,50.29 v63,50.55 | v39.12,50.55 JP8.3
  Bottom 0.254: v57.26,33.78 v62.74,33.78 | v63,50.55 v39.12,50.55
PIO1_10  (via drill 0.4)
  Top 0.254: U1.30 49.02,50.8 v50.04,51.82 | v41.66,51.82 JP8.4
  Bottom 0.254: v50.04,51.82 v41.66,51.82
PIO1_11  (via drill 0.4)
  Top 0.254: U1.42 40.7,35.25 39.88,36.07 v39.88,49.02 | v44.2,49.02 JP8.5
  Bottom 0.254: v39.88,49.02 v44.2,49.02
PIO2_1  (via drill 0.4)
  Top 0.254: U1.13 53.86,32.25 55.12,30.99 v55.12,17.53 | v38.1,17.53 38.1,4.06 JP11.2
  Bottom 0.254: v38.1,17.53 v55.12,17.53
PIO2_2  (via drill 0.4)
  Top 0.254: U1.26 51.02,43.14 v51.57,43.69 | v33.02,16 v33.02,43.69 | JP11.3 v39.12,16
  Bottom 0.254: v33.02,43.69 v51.57,43.69 | v39.12,16 v33.02,16
PIO2_3  (via drill 0.4)
  Top 0.254: U1.38 42.76,37.25 v42.17,37.85 | v37.85,19.3 v37.85,37.85 | JP11.4 v41.66,19.3
  Bottom 0.254: v37.85,37.85 v42.17,37.85 | v41.66,19.3 v37.85,19.3
PIO2_4  (via drill 0.4)
  Top 0.254: U1.18 57.46,34.75 58.17,34.04 58.17,16.51 v57.92,16.26 | JP11.5 v44.2,16.26
  Bottom 0.254: v44.2,16.26 v57.92,16.26
PIO2_5  (via drill 0.4)
  Top 0.254: U1.21 55.76,36.25 v56.34,36.83 | v60.46,36.83 60.46,14.99 v59.69,14.22 | JP11.6 v46.74,14.22
  Bottom 0.254: v60.46,36.83 v56.34,36.83 | v46.74,14.22 v59.69,14.22
PIO2_6  (via drill 0.4)
  Top 0.254: U1.1 46.02,29 45.22,28.19 v45.22,13.21 | JP11.7 v49.28,13.21
  Bottom 0.254: v49.28,13.21 v45.22,13.21
PIO2_7
  Top 0.254: U1.11 51.02,26.71 53.09,24.64 53.09,3.81 JP11.8
PIO2_8
  Top 0.254: U1.12 51.52,26.97 53.6,24.89 53.6,3.3 JP11.9
PIO2_9  (via drill 0.4)
  Top 0.254: JP11.10 56.9,26.16 v57.41,26.67 | v63.5,26.67 v63.5,41.4 | U1.24 54.26,37.75 55.38,38.86 v55.38,41.4
  Bottom 0.254: v57.41,26.67 v63.5,26.67 | v63.5,41.4 v55.38,41.4
PIO3_0  (via drill 0.4)
  Top 0.254: U1.36 46.02,53.04 v45.47,53.59 | v26.17,53.59 v26.17,61.21 | v21.34,61.21 JP13.2
  Bottom 0.254: v26.17,53.59 v45.47,53.59 | v26.17,61.21 v21.34,61.21
PIO3_1  (via drill 0.4)
  Top 0.254: U1.37 43.53,37.75 42.93,38.35 v42.93,49.78 | v28.2,49.78 28.2,63.03 JP13.3
  Bottom 0.254: v28.2,49.78 v42.93,49.78
PIO3_2  (via drill 0.4)
  Top 0.254: U1.43 40.44,34.75 39.12,36.07 39.12,48.26 v38.87,48.51 | v29.21,48.51 29.21,64.56 JP13.4
  Bottom 0.254: v38.87,48.51 v29.21,48.51
PIO3_3  (via drill 0.4)
  Top 0.254: U1.48 42.41,32.25 42.17,32 v42.17,31.24 | v30.74,30.99 30.74,65.57 JP13.5
  Bottom 0.254: v42.17,31.24 30.99,31.24 v30.74,30.99
RESET  (via drill 0.4)
  Top 0.254: BTN1.B' 91,10.35 91.19,10.16 91.61,10.16 BTN1.B | v83.32,26.42 83.32,16.26 82.38,15.32 U3.1 80.24,15.72 80.78,16.26 v81.54,16.26 | v91.44,27.69 91.44,50.29 90.43,51.31 90.43,52.44 JTAG1.10 | U1.3 47.02,27.21 v46.49,26.67 | v36.07,17.78 v36.07,26.67 | v10.42,17.02 11.71,17.02 D1.1 | v71.38,16.26 71.38,27.43 v71.63,27.69
  Top 0.406: U3.1 80.24,11.21 81.03,10.41 84.93,10.41 BTN1.B'
  Bottom 0.254: v83.32,26.42 87.09,26.42 JTAG2.15 87.13,26.92 87.89,27.69 v91.44,27.69 | v36.07,26.67 v46.49,26.67 47.5,27.69 v71.63,27.69 | v36.07,17.78 11.18,17.78 v10.42,17.02 | v71.38,16.26 v81.54,16.26
RTS  (via drill 0.4)
  Top 0.254: U1.45 40.87,33.75 40.14,33.02 v40.14,14.48 | JP5.6 v18.8,14.22
  Bottom 0.254: v40.14,14.48 19.05,14.48 v18.8,14.22
RXD  (via drill 0.4)
  Top 0.254: U1.46 41.38,33.25 40.9,32.77 40.9,11.68 v40.64,11.43 | JP5.5 v21.34,13.21
  Bottom 0.254: v40.64,11.43 23.12,11.43 v21.34,13.21
SCK  (via drill 0.4)
  Top 0.254: U1.31 48.52,52.58 v49.28,53.34 | v69.6,53.34 JP3.4
  Bottom 0.254: v49.28,53.34 v69.6,53.34
SCL  (via drill 0.4)
  Top 0.254: U1.15 55.4,33.25 56.14,32.51 56.14,19.05 v55.88,18.8 v55.88,8.64 | R3.1 63.71,18.8 v65.54,18.8 65.54,3.56 JP4.2 | v16.51,8.64 16.51,3.05 16.07,2.61 U4.1
  Bottom 0.254: v55.88,18.8 v65.54,18.8 | v16.51,8.64 v55.88,8.64
SDA  (via drill 0.4)
  Top 0.254: U1.16 56.17,33.75 v57.41,32.51 | v64.27,33.02 64.27,22.45 R2.1 63.72,21.84 66.3,21.84 67.06,21.08 JP4.3 | U4.3 14.77,5.56 v14.74,5.59
  Bottom 0.254: v57.41,32.51 63.76,32.51 v64.27,33.02 | v14.74,5.59 65.28,5.59 67.06,3.81 JP4.3
SSEL  (via drill 0.4)
  Top 0.254: JP3.5 67.06,34.54 65.54,33.02 65.54,31.35 R4.1 65.54,31.22 v65.54,25.4 | U1.10 50.52,25.94 v51.06,25.4
  Bottom 0.254: v51.06,25.4 v65.54,25.4
SWCLK  (via drill 0.4)
  Top 0.254: JTAG1.4 91.91,56.43 92.46,55.88 92.46,36.32 v93.48,35.31 | U1.29 49.52,47.49 v50.04,48.01 | v83.32,48.01 83.32,35.31 84.59,34.04 87.09,34.04 JTAG2.9
  Bottom 0.254: v93.48,35.31 88.36,35.31 JTAG2.9 | v50.04,48.01 v83.32,48.01
SWDIO  (via drill 0.4)
  Top 0.254: v93.73,37.85 92.97,38.61 92.97,56.64 91.91,57.7 JTAG1.2 90.17,57.77 v90.17,58.93 | U1.39 41.99,36.75 40.9,37.85 v40.9,56.13
  Bottom 0.254: v93.73,37.85 88.36,37.85 JTAG2.7 | v40.9,56.13 87.38,56.13 v90.17,58.93
TXD  (via drill 0.4)
  Top 0.254: U1.47 41.9,32.75 41.41,32.26 41.41,21.34 v42.17,20.57 | JP5.4 v23.88,20.57
  Bottom 0.254: v23.88,20.57 v42.17,20.57
USBCONNECT  (via drill 0.4)
  Top 0.254: U1.22 55.19,36.75 v56.34,37.9 | v59.69,37.9 59.69,21.59 v59.44,21.34 | v22.36,21.34 20.68,21.34 R12.2
  Bottom 0.254: v59.69,37.9 v56.34,37.9 | v22.36,21.34 v59.44,21.34
USBD+  (via drill 0.4)
  Top 0.254: U1.20 56.84,35.75 57.15,36.07 v57.15,40.64 | v28.2,40.64 28.2,33.02 27.44,32.26 25.63,32.26 R10.2
  Bottom 0.254: v28.2,40.64 v57.15,40.64
USBD-  (via drill 0.4)
  Top 0.254: U1.19 57.35,35.25 57.92,35.81 v57.92,39.88 | v27.44,39.88 27.44,35.05 26.93,34.54 25.63,34.54 R11.2
  Bottom 0.254: v27.44,39.88 v57.92,39.88
USBVBUS  (via drill 0.4)
  Top 0.254: U1.14 54.63,32.75 v55.12,32.26 | v29.47,42.16 v29.47,32 | v23.88,42.16 23.88,38.58 R7.2 | R7.2 23.63,38.33 | R14.2 23.53,38.23 R7.2
  Bottom 0.254: v29.47,32 51.82,32 52.07,32.26 v55.12,32.26 | v23.88,42.16 v29.47,42.16
VCC
  Top 0.61: D2.C 16.22,43.47 14.74,44.96 14.74,59.44 13.97,60.2 11.18,60.2 10.42,60.96 10.42,63.54 JP12.3
WAKEUP  (via drill 0.4)
  Top 0.254: JP6.1 82.26,67.31 81.03,67.31 80.27,66.55 R5.1 80.24,62.99 79.51,62.99 79,62.48 79,57.66 81.03,55.63 v81.03,36.32 | U1.40 46.81,36.25 v46.99,36.07
  Bottom 0.254: v46.99,36.07 80.78,36.07 v81.03,36.32
XTALIN
  Top 0.254: U1.6 48.52,23.37 48.01,22.86 47.43,22.86 Y2.2 47.41,22.46 C1.2
XTALOUT
  Top 0.254: C14.2 51.39,22.41 Y2.1 49.78,22.86 49.02,23.62 U1.7

### Text on the board
tPlace: DC | 3.0 | 3.1 | 3.2 | 3.3 | 1.8 | 1.9 | v1.6 | USB | 3.3V | GND | 3.3V | 1.10 | 1.11 | GND | 3.3V | AD3 | AD2 | AD1 | AD0 | GND | 3.3V | SCK | GND | SSEL | MOSI | MISO | GPIO3 | GPIO1 | ADC | SPI | WAKEUP | SWD | 6-12V | POWER | SWD | LPC1343 | USB | microbuilder.eu+wmt | Reference/-tard Board | 12MHz | UART(3.3V) | GPIO2 | I2C | 5.0V | BOOTLOADER | RESET | RTS | RXD | TXD | DTR | CTS | GND | 3.3V | 2.1 | 2.2 | 2.3 | 2.4 | 2.5 | 2.6 | 2.7 | 2.8 | 2.9 | GND | 3.3V | SCL | SDA | GND | 5.0V | 5.0V | GND | LED | 2.10